# Altium schematic sheet demo1.SchDoc
size A3
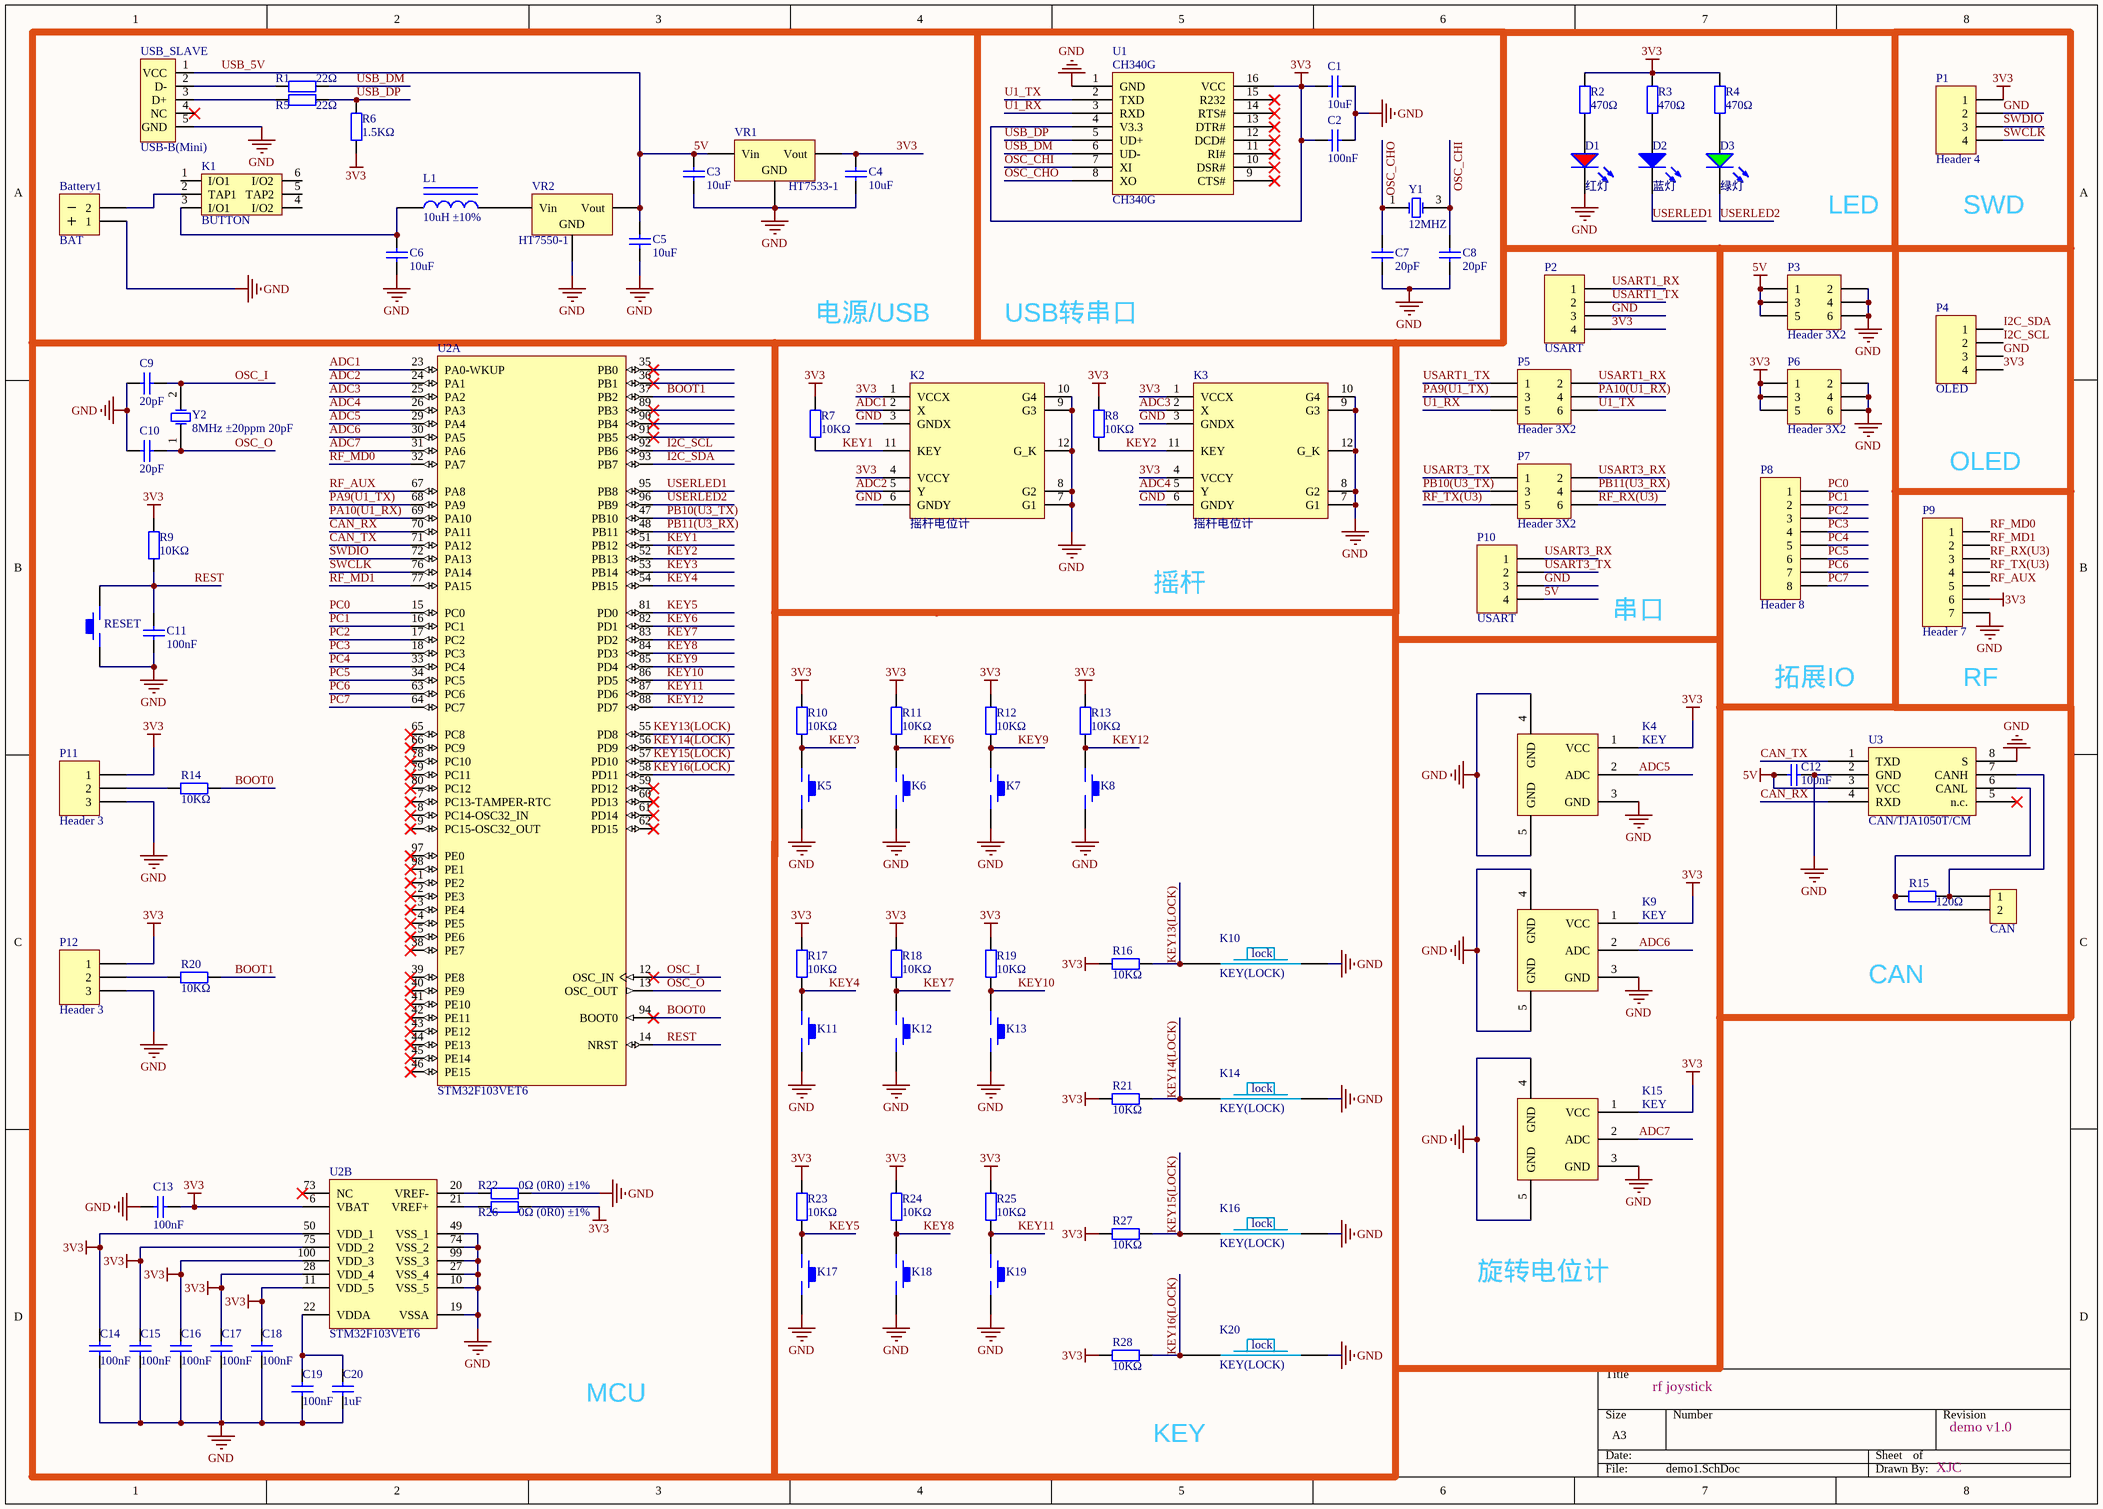
[diagram p0: demo1.SchDoc]

## Parts
*1  CAN  [CAN]
Battery1  BAT  [HDR1X2]
C1  10uF  [0603_C]
C2  100nF  [0603_C]
C3  10uF  [0603_C]
C4  10uF  [0603_C]
C5  10uF  [0603_C]
C6  10uF  [0603_C]
C7  20pF  [0603_C]
C8  20pF  [0603_C]
C9  20pF  [0603_C]
C10  20pF  [0603_C]
C11  100nF  [0603_C]
C12  100nF  [0603_C]
C13  100nF  [0603_C]
C14  100nF  [0603_C]
C15  100nF  [0603_C]
C16  100nF  [0603_C]
C17  100nF  [0603_C]
C18  100nF  [0603_C]
C19  100nF  [0603_C]
C20  1uF  [0603_C]
D1  红灯  [0603_LED_S1]
D2  蓝灯  [0603_LED_S1]
D3  绿灯  [0603_LED_S1]
K1  BUTTON  [BTN8.5*8.5]
K2  摇杆电位计  [摇杆电位计]
K3  摇杆电位计  [摇杆电位计]
K4  KEY  [旋转电位计]
K5  KEY_M  [KEY_M]  (value not drawn)
K6  KEY_M  [KEY_M]  (value not drawn)
K7  KEY_M  [KEY_M]  (value not drawn)
K8  KEY_M  [KEY_M]  (value not drawn)
K9  KEY  [旋转电位计]
K10  KEY(LOCK)  [自锁按键]
K11  KEY_M  [KEY_M]  (value not drawn)
K12  KEY_M  [KEY_M]  (value not drawn)
K13  KEY_M  [KEY_M]  (value not drawn)
K14  KEY(LOCK)  [自锁按键]
K15  KEY  [旋转电位计]
K16  KEY(LOCK)  [自锁按键]
K17  KEY_M  [KEY_M]  (value not drawn)
K18  KEY_M  [KEY_M]  (value not drawn)
K19  KEY_M  [KEY_M]  (value not drawn)
K20  KEY(LOCK)  [自锁按键]
L1  10uH ±10%  [0603_L]
P1  Header 4  [HDR1X4]
P2  USART  [HDR1X4]
P3  Header 3X2  [HDR2X3]
P4  OLED  [HDR1X4]
P5  Header 3X2  [HDR2X3]
P6  Header 3X2  [HDR2X3]
P7  Header 3X2  [HDR2X3]
P8  Header 8  [HDR1X8]
P9  Header 7  [HDR1X7]
P10  USART  [HDR1X4]
P11  Header 3  [HDR1X3]
P12  Header 3  [HDR1X3]
R1  22Ω  [0603_R]
R2  470Ω  [0603_R]
R3  470Ω  [0603_R]
R4  470Ω  [0603_R]
R5  22Ω  [0603_R]
R6  1.5KΩ  [0603_R]
R7  10KΩ  [0603_R]
R8  10KΩ  [0603_R]
R9  10KΩ  [0603_R]
R10  10KΩ  [0603_R]
R11  10KΩ  [0603_R]
R12  10KΩ  [0603_R]
R13  10KΩ  [0603_R]
R14  10KΩ  [0603_R]
R15  120Ω  [0603_R]
R16  10KΩ  [0603_R]
R17  10KΩ  [0603_R]
R18  10KΩ  [0603_R]
R19  10KΩ  [0603_R]
R20  10KΩ  [0603_R]
R21  10KΩ  [0603_R]
R22  0Ω (0R0) ±1%  [0603_R]
R23  10KΩ  [0603_R]
R24  10KΩ  [0603_R]
R25  10KΩ  [0603_R]
R26  0Ω (0R0) ±1%  [0603_R]
R27  10KΩ  [0603_R]
R28  10KΩ  [0603_R]
RESET  KEY_M  [KEY_M]  (value not drawn)
U1  CH340G  [SOIC-16_150mil]
U2  STM32F103VET6  [LQFP-100_14x14x05P]  (parts A,B of 2)
U3  CAN/TJA1050T/CM  [SOIC-8_150mil]
USB_SLAVE  USB-B(Mini)  [USB/SM0.8-6H5]
VR1  HT7533-1  [SOT-89(SOT-89-3)]
VR2  HT7550-1  [SOT-89(SOT-89-3)]
Y1  12MHZ  [SMD-3225_4P]
Y2  8MHz ±20ppm 20pF  [SMD-5032_2P]

## Nets
3V3: C1.1 C2.1 C4.2 C13.1 C14.1 C15.1 C16.1 C17.1 C18.1 K2.1(VCCX) K2.4(VCCY) K3.1(VCCX) K3.4(VCCY) K4.1(VCC) K9.1(VCC) K15.1(VCC) P1.1 P2.4 P4.4 P6.1 P6.3 P6.5 P9.6 P11.1 P12.1 R2.2 R3.2 R4.2 R6.1 R7.2 R8.2 R9.2 R10.2 R11.2 R12.2 R13.2 R16.2 R17.2 R18.2 R19.2 R21.2 R23.2 R24.2 R25.2 R26.2 R27.2 R28.2 U1.4(V3.3) U1.16(VCC) U2.6(VBAT) U2.11(VDD_5) U2.28(VDD_4) U2.50(VDD_1) U2.75(VDD_2) U2.100(VDD_3) VR1.3(Vout)
5V: C3.2 C5.2 C12.1 P3.1 P3.3 P3.5 P10.4 U3.3(VCC) USB_SLAVE.1(VCC) VR1.2(Vin) VR2.3(Vout)  [also labelled USB_5V]
GND: Battery1.1 C1.2 C2.2 C3.1 C4.1 C5.1 C6.1 C7.1 C8.1 C9.1 C10.1 C11.1 C12.2 C13.2 C14.2 C15.2 C16.2 C17.2 C18.2 C19.2 C20.1 D1.K K2.3(GNDX) K2.6(GNDY) K2.7(G1) K2.8(G2) K2.9(G3) K2.10(G4) K2.12(G_K) K3.3(GNDX) K3.6(GNDY) K3.7(G1) K3.8(G2) K3.9(G3) K3.10(G4) K3.12(G_K) K4.3(GND) K4.4(GND) K4.5(GND) K5.2 K6.2 K7.2 K8.2 K9.3(GND) K9.4(GND) K9.5(GND) K10.1 K11.2 K12.2 K13.2 K14.1 K15.3(GND) K15.4(GND) K15.5(GND) K16.1 K17.2 K18.2 K19.2 K20.1 P1.2 P2.3 P3.2 P3.4 P3.6 P4.3 P6.2 P6.4 P6.6 P9.7 P10.3 P11.3 P12.3 R22.2 RESET.1 U1.1(GND) U2.10(VSS_5) U2.19(VSSA) U2.27(VSS_4) U2.49(VSS_1) U2.74(VSS_2) U2.99(VSS_3) U3.2(GND) U3.8(S) USB_SLAVE.5(GND) VR1.1(GND) VR2.1(GND)
ADC1: K2.2(X) U2.23(PA0-WKUP)
ADC2: K2.5(Y) U2.24(PA1)
ADC3: K3.2(X) U2.25(PA2)
ADC4: K3.5(Y) U2.26(PA3)
ADC5: K4.2(ADC) U2.29(PA4)
ADC6: K9.2(ADC) U2.30(PA5)
ADC7: K15.2(ADC) U2.31(PA6)
BOOT0: R14.1 U2.94(BOOT0)
BOOT1: R20.1 U2.37(PB2)
CAN_RX: U2.70(PA11) U3.4(RXD)
CAN_TX: U2.71(PA12) U3.1(TXD)
I2C_SCL: P4.2 U2.92(PB6)
I2C_SDA: P4.1 U2.93(PB7)
KEY1: K2.11(KEY) R7.1 U2.51(PB12)
KEY2: K3.11(KEY) R8.1 U2.52(PB13)
KEY3: K5.1 R10.1 U2.53(PB14)
KEY4: K11.1 R17.1 U2.54(PB15)
KEY5: K17.1 R23.1 U2.81(PD0)
KEY6: K6.1 R11.1 U2.82(PD1)
KEY7: K12.1 R18.1 U2.83(PD2)
KEY8: K18.1 R24.1 U2.84(PD3)
KEY9: K7.1 R12.1 U2.85(PD4)
KEY10: K13.1 R19.1 U2.86(PD5)
KEY11: K19.1 R25.1 U2.87(PD6)
KEY12: K8.1 R13.1 U2.88(PD7)
KEY13(LOCK): K10.2 R16.1 U2.55(PD8)
KEY14(LOCK): K14.2 R21.1 U2.56(PD9)
KEY15(LOCK): K16.2 R27.1 U2.57(PD10)
KEY16(LOCK): K20.2 R28.1 U2.58(PD11)
OSC_CHI: C8.2 U1.7(XI) Y1.3(OSC2)
OSC_CHO: C7.2 U1.8(XO) Y1.1(OSC1)
OSC_I: C9.2 U2.12(OSC_IN) Y2.2(OSC2)
OSC_O: C10.2 U2.13(OSC_OUT) Y2.1(OSC1)
PA9(U1_TX): P5.3 U2.68(PA9)
PA10(U1_RX): P5.4 U2.69(PA10)
PB10(U3_TX): P7.3 U2.47(PB10)
PB11(U3_RX): P7.4 U2.48(PB11)
PC0: P8.1 U2.15(PC0)
PC1: P8.2 U2.16(PC1)
PC2: P8.3 U2.17(PC2)
PC3: P8.4 U2.18(PC3)
PC4: P8.5 U2.33(PC4)
PC5: P8.6 U2.34(PC5)
PC6: P8.7 U2.63(PC6)
PC7: P8.8 U2.64(PC7)
REST: C11.2 R9.1 RESET.2 U2.14(NRST)
RF_AUX: P9.5 U2.67(PA8)
RF_MD0: P9.1 U2.32(PA7)
RF_MD1: P9.2 U2.77(PA15)
RF_RX(U3): P7.6 P9.3
RF_TX(U3): P7.5 P9.4
SWCLK: P1.4 U2.76(PA14)
SWDIO: P1.3 U2.72(PA13)
U1_RX: P5.5 U1.3(RXD)
U1_TX: P5.6 U1.2(TXD)
USART1_RX: P2.1 P5.2
USART1_TX: P2.2 P5.1
USART3_RX: P7.2 P10.1
USART3_TX: P7.1 P10.2
USB_DM: R1.2 U1.6(UD-)
USB_DP: R5.2 R6.2 U1.5(UD+)
USERLED1: D2.K U2.95(PB8)
USERLED2: D3.K U2.96(PB9)
Net*1_1: *1.1 R15.2 U3.7(CANH)
Net*1_2: *1.2 R15.1 U3.6(CANL)
NetBattery1_2: Battery1.2 K1.2(TAP1)
NetC6_2: C6.2 K1.3(I/O1) L1.1
NetC19_1: C19.1 C20.2 U2.22(VDDA)
NetD1_A: D1.A R2.1
NetD2_A: D2.A R3.1
NetD3_A: D3.A R4.1
NetL1_2: L1.2 VR2.2(Vin)
NetP11_2: P11.2 R14.2
NetP12_2: P12.2 R20.2
NetR1_1: R1.1 USB_SLAVE.2(D-)
NetR5_1: R5.1 USB_SLAVE.3(D+)
NetR22_1: R22.1 U2.20(VREF-)
NetR26_1: R26.1 U2.21(VREF+)

Not connected (* = marked no-connect by the designer): K1 1(I/O1) 4(I/O2) 5(TAP2) 6(I/O2); U1 9(CTS#)* 10(DSR#)* 11(RI#)* 12(DCD#)* 13(DTR#)* 14(RTS#)* 15(R232)*; U2 1(PE2)* 2(PE3)* 3(PE4)* 4(PE5)* 5(PE6)* 7(PC13-TAMPER-RTC)* 8(PC14-OSC32_IN)* 9(PC15-OSC32_OUT)* 35(PB0)* 36(PB1)* 38(PE7)* 39(PE8)* 40(PE9)* 41(PE10)* 42(PE11)* 43(PE12)* 44(PE13)* 45(PE14)* 46(PE15)* 59(PD12)* 60(PD13)* 61(PD14)* 62(PD15)* 65(PC8)* 66(PC9)* 73(NC)* 78(PC10)* 79(PC11)* 80(PC12)* 89(PB3)* 90(PB4)* 91(PB5)* 97(PE0)* 98(PE1)*; U3 5(n.c.)*; USB_SLAVE 4(NC)*

## Notes on the sheet
- LED
- (near P1) SWD
- 电源/USB
- USB转串口
- OLED
- 摇杆
- 串口
- 拓展IO
- RF
- CAN
- 旋转电位计
- rf joystick
- MCU
- KEY
- demo v1.0
- XJC
- Labels drawn without touching a wire or pin: 3V3
- (in symbol 自锁按键) lock

## Library data of the parts
Battery1 = BAT: Header, 2-Pin; Publisher: mazhongwei; Published: 8-August-2017; PackageReference: HDR1X2
C1 C3-C6 = 0603 10uF (106) 10% 10V: 贴片电容; ComponentLink1Description: 供应商链接; ComponentLink1URL: http://www.szlcsc.com/product/details_20411.html; Package: 0603; Supplier: LC; SuppliersPartNumber: C19702
C2 C11-C19 = 0603 100nF (104) 10% 50V: 贴片电容; ComponentLink1Description: 供应商链接; ComponentLink1URL: http://www.szlcsc.com/product/details_15331.html; Package: 0603; Supplier: LC; SuppliersPartNumber: C14663
C7-C10 = 0603 20pF (200) 5% 50V: 贴片电容; ComponentLink1Description: 供应商链接; ComponentLink1URL: http://www.szlcsc.com/product/details_2000.html; Package: 0603; Supplier: LC; SuppliersPartNumber: C1648
C20 = 0603 1uF (105) 10% 50V: 贴片电容; ComponentLink1Description: 供应商链接; ComponentLink1URL: http://www.szlcsc.com/product/details_16531.html; Package: 0603; Supplier: LC; SuppliersPartNumber: C15849
D1 = 0603 红灯: 发光二极管; ComponentLink1Description: 供应商链接; ComponentLink1URL: http://www.szlcsc.com/product/details_2659.html; Package: 0603; Supplier: LC; SuppliersPartNumber: C2286
D2 = 0603 蓝灯: 发光二极管; ComponentLink1Description: 供应商链接; ComponentLink1URL: http://www.szlcsc.com/product/details_73150.html; Package: 0603; Supplier: LC; SuppliersPartNumber: C72041
D3 = 0603 绿灯: 发光二极管; ComponentLink1Description: 供应商链接; ComponentLink1URL: http://www.szlcsc.com/product/details_73152.html; Package: 0603; Supplier: LC; SuppliersPartNumber: C72043
K4 K9 K15 = 旋转电位计
K10 K14 K16 K20 = 自锁按键
L1 = 0603 10uH 10%: 贴片电感; ComponentLink1Description: 供应商链接; ComponentLink1URL: http://www.szlcsc.com/product/details_1387.html; Package: 0603; Supplier: LC; SuppliersPartNumber: C1035
P1 P2 P4 P10 = Header 4: Header, 4-Pin; LatestRevisionDate: 17-Jul-2002; LatestRevisionNote: Re-released for DXP Platform.; Publisher: Altium Limited
P3 P5-P7 = Header 3X2: Header, 3-Pin, Dual row; LatestRevisionDate: 17-Jul-2002; LatestRevisionNote: Re-released for DXP Platform.; Publisher: Altium Limited
P8 = Header 8: Header, 8-Pin; LatestRevisionDate: 17-Jul-2002; LatestRevisionNote: Re-released for DXP Platform.; Publisher: Altium Limited
P9 = Header 7: Header, 7-Pin; LatestRevisionDate: 17-Jul-2002; LatestRevisionNote: Re-released for DXP Platform.; Publisher: Altium Limited
P11 P12 = Header 3: Header, 3-Pin; LatestRevisionDate: 17-Jul-2002; LatestRevisionNote: Re-released for DXP Platform.; Publisher: Altium Limited
R1 R5 = 0603 22Ω (22R0) 1%: 贴片电阻; ComponentLink1Description: 供应商链接; ComponentLink1URL: http://www.szlcsc.com/product/details_24078.html; Package: 0603; Supplier: LC; SuppliersPartNumber: C23345
R2-R4 = 0603 470Ω (4700) 1%: 贴片电阻; ComponentLink1Description: 供应商链接; ComponentLink1URL: http://www.szlcsc.com/product/details_23906.html; Package: 0603; Supplier: LC; SuppliersPartNumber: C23179
R6 = 0603 1.5KΩ (1501) 1%: 贴片电阻; ComponentLink1Description: 供应商链接; ComponentLink1URL: http://www.szlcsc.com/product/details_23570.html; Package: 0603; Supplier: LC; SuppliersPartNumber: C22843
R7-R14 R16-R21 R23-R25 R27 R28 = 0603 10KΩ (1002) 1%: 贴片电阻; ComponentLink1Description: 供应商链接; ComponentLink1URL: http://www.szlcsc.com/product/details_26547.html; Package: 0603; Supplier: LC; SuppliersPartNumber: C25804
R15 = 0603 120Ω (1200) 1%: 贴片电阻; ComponentLink1Description: 供应商链接; ComponentLink1URL: http://www.szlcsc.com/product/details_23514.html; Package: 0603; Supplier: LC; SuppliersPartNumber: C22787
R22 R26 = 0603 0Ω (0R0) 1%: 贴片电阻; ComponentLink1Description: 供应商链接; ComponentLink1URL: http://www.szlcsc.com/product/details_21903.html; Package: 0603; Supplier: LC; SuppliersPartNumber: C21189
U1 = CH340G_[C14267]: USB; ComponentLink1Description: 供应商链接; ComponentLink1URL: http://www.szlcsc.com/product/details_14927.html; Package: SOIC-16_150mil; Supplier: LC; SuppliersPartNumber: C14267
U2 = STM32F103VET6: ARM; ComponentLink1Description: 供应商链接; ComponentLink1URL: http://www.szlcsc.com/product/details_8800.html; Package: LQFP-100_14x14x05P; Supplier: LC; SuppliersPartNumber: C8308
U3 = CAN/TJA1050T/CM_[C6952]: CAN; ComponentLink1Description: 供应商链接; ComponentLink1URL: http://www.szlcsc.com/product/details_7424.html; Package: SOIC-8_150mil; Supplier: LC; SuppliersPartNumber: C6952
USB_SLAVE = USB5
VR1 = SOT-89 HT7533-1: 低压差线性稳压(LDO); ComponentLink1Description: 供应商链接; ComponentLink1URL: http://www.szlcsc.com/product/details_14949.html; Package: SOT-89; Supplier: LC; SuppliersPartNumber: C14289
VR2 = SOT-89 HT7550-1: 低压差线性稳压(LDO); ComponentLink1Description: 供应商链接; ComponentLink1URL: http://www.szlcsc.com/product/details_16788.html; Package: SOT-89; Supplier: LC; SuppliersPartNumber: C16106
Y1 = SMD-3225_4P  12MHZ 20PF 10PPM: 贴片晶振; ComponentLink1Description: 供应商链接; ComponentLink1URL: http://www.szlcsc.com/product/details_9522.html; Package: SMD-3225_4P; Supplier: LC; SuppliersPartNumber: C9002
Y2 = SMD-5032_2P 8MHz 20ppm 20pF: 贴片晶振; ComponentLink1Description: 供应商链接; ComponentLink1URL: http://www.szlcsc.com/product/details_117214.html; Package: SMD-5032_2P; Supplier: LC; SuppliersPartNumber: C115962